# EAGLE schematic untitled (EAGLE 9.3.0)
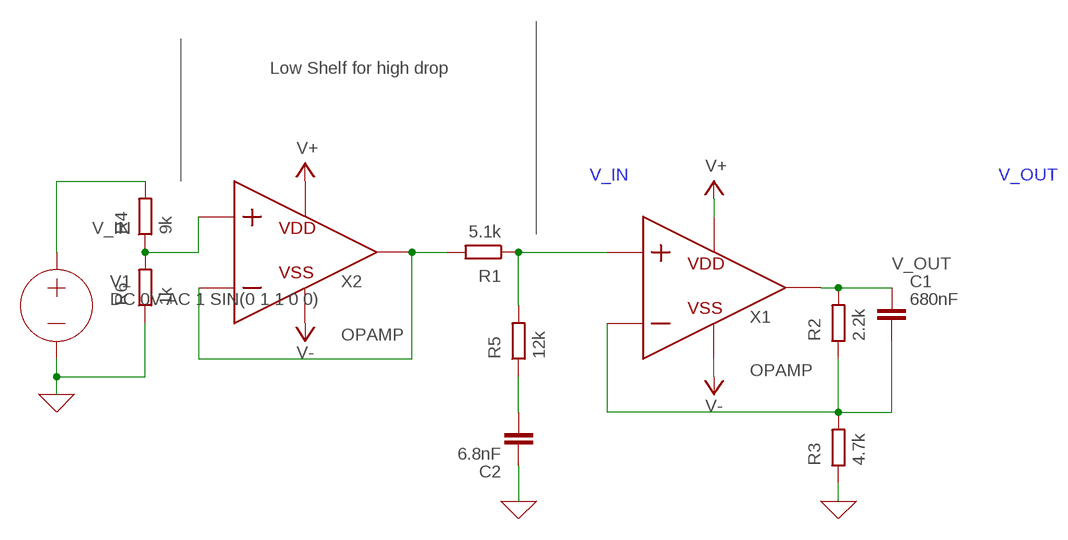
[diagram p0: schematic, sheet 1]

## Parts
C1  680nF  C  (no package)
C2  6.8nF  C  (no package)
R1  5.1k  R  (no package)
R2  2.2k  R  (no package)
R3  4.7k  R  (no package)
R4  9k  R  (no package)
R5  12k  R  (no package)
R6  1k  R  (no package)
V1  DC 0V AC 1 SIN(0 1 1 0 0)  VOLTAGE  (no package)
X1  OPAMP  (no package)
X2  OPAMP  (no package)

## Nets
0: C2.1 R3.1 R6.1 V1.- ; supply symbol labelled GND
N$1: C1.2 R2.1 R3.2 X1.N
N$3: R4.2 V1.+
N$4: C2.2 R5.1
N$5: R1.2 X2.N X2.VOUT
N$6: R4.1 R6.2 X2.P
V+: X1.VDD X2.VDD
V-: X1.VSS X2.VSS
V_IN: R1.1 R5.2 X1.P
V_OUT: C1.1 R2.2 X1.VOUT

## Notes on the sheet
- Low Shelf for high drop

## Library data of the parts
C1 C2 = ngspice-simulation:C: CAPACITOR
R1-R6 = ngspice-simulation:R: RESISTOR
V1 = ngspice-simulation:VOLTAGE: Independent Voltage Source, either DC, AC, PULSE, SINE, PWL, EXP, or SFFM; VALUE: 0V
X1 X2 = ngspice-simulation:OPAMP: Operational amplifier with power pins